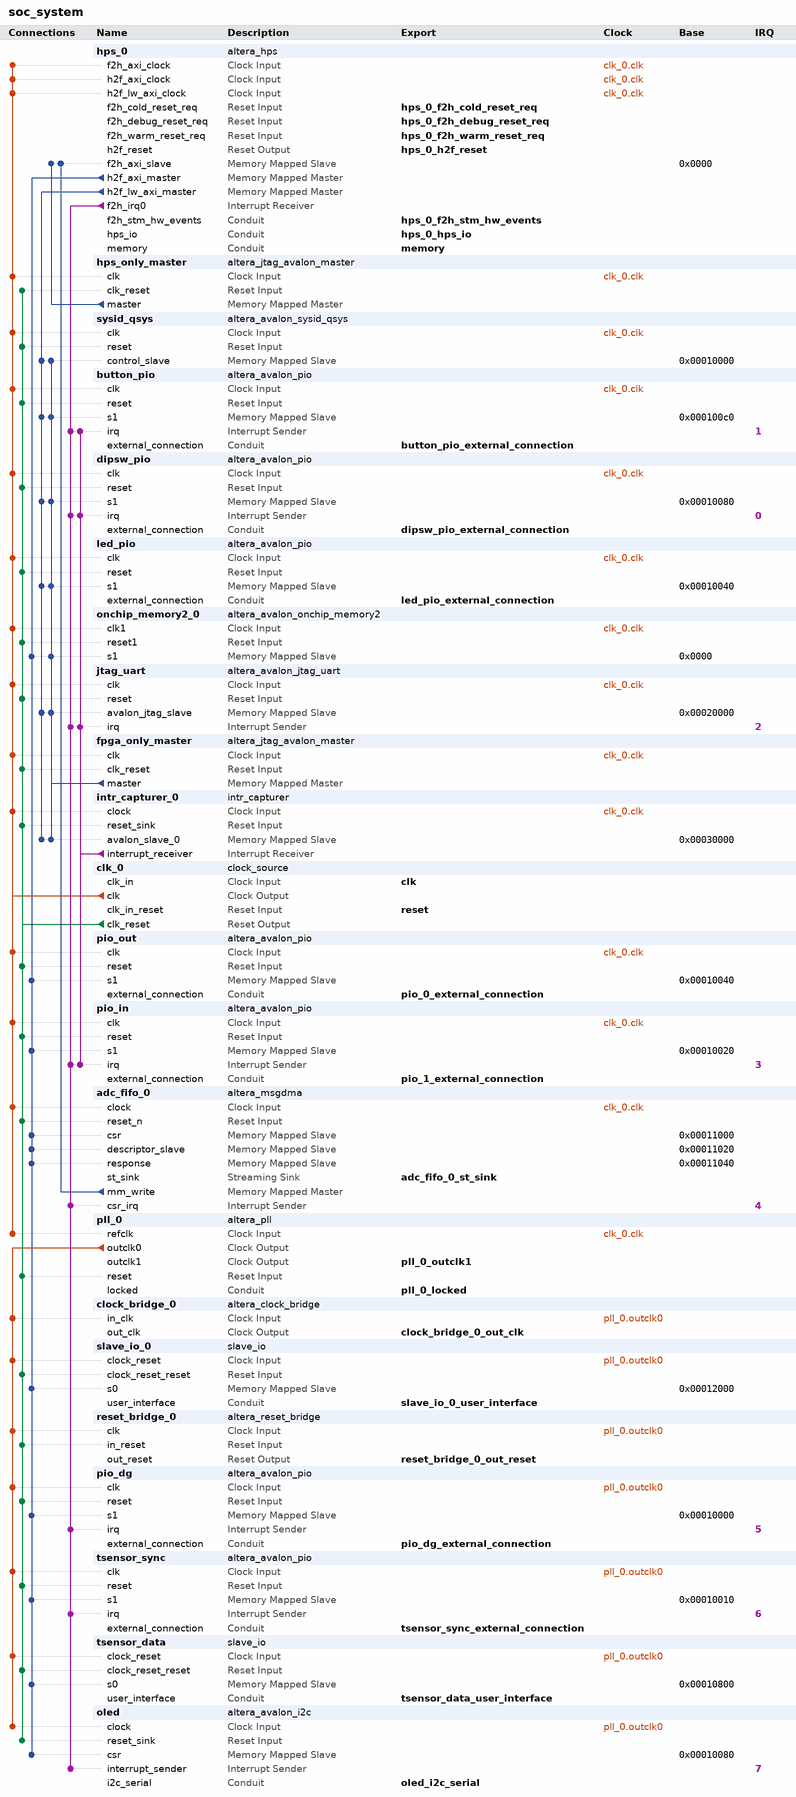
[diagram p0: system contents]
# Platform Designer (Qsys) system soc_system, Cyclone V 5CSEMA4U23C6
# Parameters at their usual value, and those the tool derives, are not listed.
package require -exact qsys 20.1
create_system soc_system
set_project_property DEVICE_FAMILY {Cyclone V}
set_project_property DEVICE 5CSEMA4U23C6

add_instance hps_0 altera_hps 20.1
set_instance_parameter_value hps_0 EMAC1_Mode RGMII
set_instance_parameter_value hps_0 EMAC1_PinMuxing {HPS I/O Set 0}
set_instance_parameter_value hps_0 F2SCLK_COLDRST_Enable true
set_instance_parameter_value hps_0 F2SCLK_DBGRST_Enable true
set_instance_parameter_value hps_0 F2SCLK_WARMRST_Enable true
set_instance_parameter_value hps_0 F2SINTERRUPT_Enable true
set_instance_parameter_value hps_0 F2S_Width 3
set_instance_parameter_value hps_0 FPGA_PERIPHERAL_OUTPUT_CLOCK_FREQ_EMAC0_GTX_CLK 100
set_instance_parameter_value hps_0 FPGA_PERIPHERAL_OUTPUT_CLOCK_FREQ_EMAC0_MD_CLK 100.0
set_instance_parameter_value hps_0 FPGA_PERIPHERAL_OUTPUT_CLOCK_FREQ_EMAC1_GTX_CLK 100
set_instance_parameter_value hps_0 FPGA_PERIPHERAL_OUTPUT_CLOCK_FREQ_EMAC1_MD_CLK 100.0
set_instance_parameter_value hps_0 HPS_PROTOCOL DDR3
set_instance_parameter_value hps_0 I2C0_Mode I2C
set_instance_parameter_value hps_0 I2C0_PinMuxing {HPS I/O Set 0}
set_instance_parameter_value hps_0 I2C1_Mode I2C
set_instance_parameter_value hps_0 I2C1_PinMuxing {HPS I/O Set 0}
set_instance_parameter_value hps_0 LWH2F_Enable true
set_instance_parameter_value hps_0 MEM_BANKADDR_WIDTH 3
set_instance_parameter_value hps_0 MEM_CLK_FREQ 400.0
set_instance_parameter_value hps_0 MEM_COL_ADDR_WIDTH 10
set_instance_parameter_value hps_0 MEM_DQ_WIDTH 32
set_instance_parameter_value hps_0 MEM_DRV_STR RZQ/6
set_instance_parameter_value hps_0 MEM_ROW_ADDR_WIDTH 15
set_instance_parameter_value hps_0 MEM_RTT_NOM RZQ/6
set_instance_parameter_value hps_0 MEM_RTT_WR {Dynamic ODT off}
set_instance_parameter_value hps_0 MEM_TCL 7
set_instance_parameter_value hps_0 MEM_TFAW_NS 37.5
set_instance_parameter_value hps_0 MEM_TRAS_NS 35.0
set_instance_parameter_value hps_0 MEM_TRCD_NS 13.75
set_instance_parameter_value hps_0 MEM_TRFC_NS 300.0
set_instance_parameter_value hps_0 MEM_TRP_NS 13.75
set_instance_parameter_value hps_0 MEM_VENDOR Other
set_instance_parameter_value hps_0 MEM_WTCL 7
set_instance_parameter_value hps_0 QSPI_Mode N/A
set_instance_parameter_value hps_0 QSPI_PinMuxing Unused
set_instance_parameter_value hps_0 REF_CLK_FREQ 25.0
set_instance_parameter_value hps_0 S2FCLK_USER2CLK 5
set_instance_parameter_value hps_0 S2F_Width 2
set_instance_parameter_value hps_0 SDIO_Mode {4-bit Data}
set_instance_parameter_value hps_0 SDIO_PinMuxing {HPS I/O Set 0}
set_instance_parameter_value hps_0 SPIM1_Mode {Single Slave Select}
set_instance_parameter_value hps_0 SPIM1_PinMuxing {HPS I/O Set 0}
set_instance_parameter_value hps_0 STM_Enable true
set_instance_parameter_value hps_0 TIMING_BOARD_AC_SKEW 0.02
set_instance_parameter_value hps_0 TIMING_BOARD_AC_TO_CK_SKEW 0.0
set_instance_parameter_value hps_0 TIMING_BOARD_DQ_TO_DQS_SKEW 0.0
set_instance_parameter_value hps_0 TIMING_BOARD_MAX_CK_DELAY 0.6
set_instance_parameter_value hps_0 TIMING_BOARD_MAX_DQS_DELAY 0.6
set_instance_parameter_value hps_0 TIMING_BOARD_SKEW_BETWEEN_DQS 0.02
set_instance_parameter_value hps_0 TIMING_BOARD_SKEW_CKDQS_DIMM_MAX 0.01
set_instance_parameter_value hps_0 TIMING_BOARD_SKEW_CKDQS_DIMM_MIN -0.01
set_instance_parameter_value hps_0 TIMING_BOARD_SKEW_WITHIN_DQS 0.02
set_instance_parameter_value hps_0 TIMING_TDH 125
set_instance_parameter_value hps_0 TIMING_TDQSCK 400
set_instance_parameter_value hps_0 TIMING_TDQSQ 120
set_instance_parameter_value hps_0 TIMING_TDS 50
set_instance_parameter_value hps_0 TIMING_TIH 250
set_instance_parameter_value hps_0 TIMING_TIS 175
set_instance_parameter_value hps_0 TIMING_TQSH 0.38
set_instance_parameter_value hps_0 UART0_Mode {No Flow Control}
set_instance_parameter_value hps_0 UART0_PinMuxing {HPS I/O Set 0}
set_instance_parameter_value hps_0 USB1_Mode SDR
set_instance_parameter_value hps_0 USB1_PinMuxing {HPS I/O Set 0}
set_instance_parameter_value hps_0 desired_cfg_clk_mhz 100.0
set_instance_parameter_value hps_0 desired_qspi_clk_mhz 370.0

add_instance hps_only_master altera_jtag_avalon_master 20.1

add_instance sysid_qsys altera_avalon_sysid_qsys 20.1
set_instance_parameter_value sysid_qsys id -1395322110

add_instance button_pio altera_avalon_pio 20.1
set_instance_parameter_value button_pio bitClearingEdgeCapReg true
set_instance_parameter_value button_pio captureEdge true
set_instance_parameter_value button_pio direction Input
set_instance_parameter_value button_pio edgeType FALLING
set_instance_parameter_value button_pio generateIRQ true
set_instance_parameter_value button_pio irqType EDGE
set_instance_parameter_value button_pio width 4

add_instance dipsw_pio altera_avalon_pio 20.1
set_instance_parameter_value dipsw_pio bitClearingEdgeCapReg true
set_instance_parameter_value dipsw_pio captureEdge true
set_instance_parameter_value dipsw_pio direction Input
set_instance_parameter_value dipsw_pio edgeType ANY
set_instance_parameter_value dipsw_pio generateIRQ true
set_instance_parameter_value dipsw_pio irqType EDGE
set_instance_parameter_value dipsw_pio width 4

add_instance led_pio altera_avalon_pio 20.1
set_instance_parameter_value led_pio direction Output
set_instance_parameter_value led_pio width 8

add_instance onchip_memory2_0 altera_avalon_onchip_memory2 20.1
set_instance_parameter_value onchip_memory2_0 dataWidth 64
set_instance_parameter_value onchip_memory2_0 dualPort false
set_instance_parameter_value onchip_memory2_0 initMemContent true
set_instance_parameter_value onchip_memory2_0 initializationFileName onchip_memory2_0
set_instance_parameter_value onchip_memory2_0 memorySize 65536

add_instance jtag_uart altera_avalon_jtag_uart 20.1
set_instance_parameter_value jtag_uart allowMultipleConnections true
set_instance_parameter_value jtag_uart simInteractiveOptions INTERACTIVE_ASCII_OUTPUT

add_instance fpga_only_master altera_jtag_avalon_master 20.1

add_instance intr_capturer_0 intr_capturer 100.99.98.97

add_instance clk_0 clock_source 20.1
set_instance_parameter_value clk_0 clockFrequency 50000000

add_instance pio_out altera_avalon_pio 20.1
set_instance_parameter_value pio_out direction Output
set_instance_parameter_value pio_out resetValue 15
set_instance_parameter_value pio_out width 4

add_instance pio_in altera_avalon_pio 20.1
set_instance_parameter_value pio_in bitClearingEdgeCapReg true
set_instance_parameter_value pio_in captureEdge true
set_instance_parameter_value pio_in direction Input
set_instance_parameter_value pio_in edgeType FALLING
set_instance_parameter_value pio_in generateIRQ true
set_instance_parameter_value pio_in irqType EDGE
set_instance_parameter_value pio_in width 2

add_instance adc_fifo_0 altera_msgdma 20.1
set_instance_parameter_value adc_fifo_0 BURST_ENABLE 0
set_instance_parameter_value adc_fifo_0 DATA_FIFO_DEPTH 32
set_instance_parameter_value adc_fifo_0 DATA_WIDTH 512
set_instance_parameter_value adc_fifo_0 DESCRIPTOR_FIFO_DEPTH 128
set_instance_parameter_value adc_fifo_0 ENHANCED_FEATURES 0
set_instance_parameter_value adc_fifo_0 ERROR_ENABLE 0
set_instance_parameter_value adc_fifo_0 MAX_BURST_COUNT 2
set_instance_parameter_value adc_fifo_0 MAX_BYTE 1024
set_instance_parameter_value adc_fifo_0 MODE 2
set_instance_parameter_value adc_fifo_0 PACKET_ENABLE 1
set_instance_parameter_value adc_fifo_0 RESPONSE_PORT 0
set_instance_parameter_value adc_fifo_0 TRANSFER_TYPE {Aligned Accesses}

add_instance pll_0 altera_pll 20.1
set_instance_parameter_value pll_0 gui_device_speed_grade 1
set_instance_parameter_value pll_0 gui_number_of_clocks 2
set_instance_parameter_value pll_0 gui_operation_mode direct
set_instance_parameter_value pll_0 gui_output_clock_frequency0 100.0
set_instance_parameter_value pll_0 gui_output_clock_frequency1 1.0
set_instance_parameter_value pll_0 gui_pll_mode {Integer-N PLL}
set_instance_parameter_value pll_0 gui_reference_clock_frequency 50.0
set_instance_parameter_value pll_0 gui_use_locked true

add_instance clock_bridge_0 altera_clock_bridge 20.1
set_instance_parameter_value clock_bridge_0 DERIVED_CLOCK_RATE 100000000
set_instance_parameter_value clock_bridge_0 EXPLICIT_CLOCK_RATE 0

add_instance slave_io_0 slave_io 2.0
set_instance_parameter_value slave_io_0 DATA_WIDTH 64
set_instance_parameter_value slave_io_0 ENABLE_SYNC_SIGNALS 1
set_instance_parameter_value slave_io_0 IRQ_EN 0
set_instance_parameter_value slave_io_0 MODE_0 2
set_instance_parameter_value slave_io_0 MODE_1 2
set_instance_parameter_value slave_io_0 MODE_10 2
set_instance_parameter_value slave_io_0 MODE_11 2
set_instance_parameter_value slave_io_0 MODE_12 2
set_instance_parameter_value slave_io_0 MODE_13 2
set_instance_parameter_value slave_io_0 MODE_14 2
set_instance_parameter_value slave_io_0 MODE_15 2
set_instance_parameter_value slave_io_0 MODE_2 2
set_instance_parameter_value slave_io_0 MODE_3 2
set_instance_parameter_value slave_io_0 MODE_4 2
set_instance_parameter_value slave_io_0 MODE_5 2
set_instance_parameter_value slave_io_0 MODE_6 2
set_instance_parameter_value slave_io_0 MODE_7 2
set_instance_parameter_value slave_io_0 MODE_8 2
set_instance_parameter_value slave_io_0 MODE_9 2

add_instance reset_bridge_0 altera_reset_bridge 20.1
set_instance_parameter_value reset_bridge_0 ACTIVE_LOW_RESET 1
set_instance_parameter_value reset_bridge_0 SYNCHRONOUS_EDGES deassert

add_instance pio_dg altera_avalon_pio 20.1
set_instance_parameter_value pio_dg bitClearingEdgeCapReg true
set_instance_parameter_value pio_dg captureEdge true
set_instance_parameter_value pio_dg direction Input
set_instance_parameter_value pio_dg generateIRQ true
set_instance_parameter_value pio_dg irqType EDGE
set_instance_parameter_value pio_dg width 1

add_instance tsensor_sync altera_avalon_pio 20.1
set_instance_parameter_value tsensor_sync bitClearingEdgeCapReg true
set_instance_parameter_value tsensor_sync captureEdge true
set_instance_parameter_value tsensor_sync direction Input
set_instance_parameter_value tsensor_sync generateIRQ true
set_instance_parameter_value tsensor_sync irqType EDGE
set_instance_parameter_value tsensor_sync width 1

add_instance tsensor_data slave_io 2.0
set_instance_parameter_value tsensor_data DATA_WIDTH 32
set_instance_parameter_value tsensor_data ENABLE_SYNC_SIGNALS 1
set_instance_parameter_value tsensor_data IRQ_EN 0
set_instance_parameter_value tsensor_data MODE_0 2
set_instance_parameter_value tsensor_data MODE_1 2
set_instance_parameter_value tsensor_data MODE_10 2
set_instance_parameter_value tsensor_data MODE_11 2
set_instance_parameter_value tsensor_data MODE_12 2
set_instance_parameter_value tsensor_data MODE_13 2
set_instance_parameter_value tsensor_data MODE_14 2
set_instance_parameter_value tsensor_data MODE_15 2
set_instance_parameter_value tsensor_data MODE_2 2
set_instance_parameter_value tsensor_data MODE_3 2
set_instance_parameter_value tsensor_data MODE_4 2
set_instance_parameter_value tsensor_data MODE_5 2
set_instance_parameter_value tsensor_data MODE_6 2
set_instance_parameter_value tsensor_data MODE_7 2
set_instance_parameter_value tsensor_data MODE_8 2
set_instance_parameter_value tsensor_data MODE_9 2

add_instance oled altera_avalon_i2c 20.1
set_instance_parameter_value oled FIFO_DEPTH 4

# connections
add_connection clk_0.clk adc_fifo_0.clock clock
add_connection clk_0.clk button_pio.clk clock
add_connection clk_0.clk dipsw_pio.clk clock
add_connection clk_0.clk fpga_only_master.clk clock
add_connection clk_0.clk hps_0.f2h_axi_clock clock
add_connection clk_0.clk hps_0.h2f_axi_clock clock
add_connection clk_0.clk hps_0.h2f_lw_axi_clock clock
add_connection clk_0.clk hps_only_master.clk clock
add_connection clk_0.clk intr_capturer_0.clock clock
add_connection clk_0.clk jtag_uart.clk clock
add_connection clk_0.clk led_pio.clk clock
add_connection clk_0.clk onchip_memory2_0.clk1 clock
add_connection clk_0.clk pio_in.clk clock
add_connection clk_0.clk pio_out.clk clock
add_connection clk_0.clk pll_0.refclk clock
add_connection clk_0.clk sysid_qsys.clk clock
add_connection pll_0.outclk0 clock_bridge_0.in_clk clock
add_connection pll_0.outclk0 oled.clock clock
add_connection pll_0.outclk0 pio_dg.clk clock
add_connection pll_0.outclk0 reset_bridge_0.clk clock
add_connection pll_0.outclk0 slave_io_0.clock_reset clock
add_connection pll_0.outclk0 tsensor_data.clock_reset clock
add_connection pll_0.outclk0 tsensor_sync.clk clock
add_connection clk_0.clk_reset adc_fifo_0.reset_n reset
add_connection clk_0.clk_reset button_pio.reset reset
add_connection clk_0.clk_reset dipsw_pio.reset reset
add_connection clk_0.clk_reset fpga_only_master.clk_reset reset
add_connection clk_0.clk_reset hps_only_master.clk_reset reset
add_connection clk_0.clk_reset intr_capturer_0.reset_sink reset
add_connection clk_0.clk_reset jtag_uart.reset reset
add_connection clk_0.clk_reset led_pio.reset reset
add_connection clk_0.clk_reset oled.reset_sink reset
add_connection clk_0.clk_reset onchip_memory2_0.reset1 reset
add_connection clk_0.clk_reset pio_dg.reset reset
add_connection clk_0.clk_reset pio_in.reset reset
add_connection clk_0.clk_reset pio_out.reset reset
add_connection clk_0.clk_reset pll_0.reset reset
add_connection clk_0.clk_reset reset_bridge_0.in_reset reset
add_connection clk_0.clk_reset slave_io_0.clock_reset_reset reset
add_connection clk_0.clk_reset sysid_qsys.reset reset
add_connection clk_0.clk_reset tsensor_data.clock_reset_reset reset
add_connection clk_0.clk_reset tsensor_sync.reset reset
add_connection adc_fifo_0.mm_write hps_0.f2h_axi_slave avalon
set_connection_parameter_value adc_fifo_0.mm_write/hps_0.f2h_axi_slave baseAddress 0x0000
add_connection fpga_only_master.master button_pio.s1 avalon
set_connection_parameter_value fpga_only_master.master/button_pio.s1 baseAddress 0x000100c0
add_connection fpga_only_master.master dipsw_pio.s1 avalon
set_connection_parameter_value fpga_only_master.master/dipsw_pio.s1 baseAddress 0x00010080
add_connection fpga_only_master.master intr_capturer_0.avalon_slave_0 avalon
set_connection_parameter_value fpga_only_master.master/intr_capturer_0.avalon_slave_0 baseAddress 0x00030000
add_connection fpga_only_master.master jtag_uart.avalon_jtag_slave avalon
set_connection_parameter_value fpga_only_master.master/jtag_uart.avalon_jtag_slave baseAddress 0x00020000
add_connection fpga_only_master.master led_pio.s1 avalon
set_connection_parameter_value fpga_only_master.master/led_pio.s1 baseAddress 0x00010040
add_connection fpga_only_master.master onchip_memory2_0.s1 avalon
set_connection_parameter_value fpga_only_master.master/onchip_memory2_0.s1 baseAddress 0x0000
add_connection fpga_only_master.master sysid_qsys.control_slave avalon
set_connection_parameter_value fpga_only_master.master/sysid_qsys.control_slave baseAddress 0x00010000
add_connection hps_0.h2f_axi_master adc_fifo_0.csr avalon
set_connection_parameter_value hps_0.h2f_axi_master/adc_fifo_0.csr baseAddress 0x00011000
add_connection hps_0.h2f_axi_master adc_fifo_0.descriptor_slave avalon
set_connection_parameter_value hps_0.h2f_axi_master/adc_fifo_0.descriptor_slave baseAddress 0x00011020
add_connection hps_0.h2f_axi_master adc_fifo_0.response avalon
set_connection_parameter_value hps_0.h2f_axi_master/adc_fifo_0.response baseAddress 0x00011040
add_connection hps_0.h2f_axi_master oled.csr avalon
set_connection_parameter_value hps_0.h2f_axi_master/oled.csr baseAddress 0x00010080
add_connection hps_0.h2f_axi_master onchip_memory2_0.s1 avalon
set_connection_parameter_value hps_0.h2f_axi_master/onchip_memory2_0.s1 baseAddress 0x0000
add_connection hps_0.h2f_axi_master pio_dg.s1 avalon
set_connection_parameter_value hps_0.h2f_axi_master/pio_dg.s1 baseAddress 0x00010000
add_connection hps_0.h2f_axi_master pio_in.s1 avalon
set_connection_parameter_value hps_0.h2f_axi_master/pio_in.s1 baseAddress 0x00010020
add_connection hps_0.h2f_axi_master pio_out.s1 avalon
set_connection_parameter_value hps_0.h2f_axi_master/pio_out.s1 baseAddress 0x00010040
add_connection hps_0.h2f_axi_master slave_io_0.s0 avalon
set_connection_parameter_value hps_0.h2f_axi_master/slave_io_0.s0 baseAddress 0x00012000
add_connection hps_0.h2f_axi_master tsensor_data.s0 avalon
set_connection_parameter_value hps_0.h2f_axi_master/tsensor_data.s0 baseAddress 0x00010800
add_connection hps_0.h2f_axi_master tsensor_sync.s1 avalon
set_connection_parameter_value hps_0.h2f_axi_master/tsensor_sync.s1 baseAddress 0x00010010
add_connection hps_0.h2f_lw_axi_master button_pio.s1 avalon
set_connection_parameter_value hps_0.h2f_lw_axi_master/button_pio.s1 baseAddress 0x000100c0
add_connection hps_0.h2f_lw_axi_master dipsw_pio.s1 avalon
set_connection_parameter_value hps_0.h2f_lw_axi_master/dipsw_pio.s1 baseAddress 0x00010080
add_connection hps_0.h2f_lw_axi_master intr_capturer_0.avalon_slave_0 avalon
set_connection_parameter_value hps_0.h2f_lw_axi_master/intr_capturer_0.avalon_slave_0 baseAddress 0x00030000
add_connection hps_0.h2f_lw_axi_master jtag_uart.avalon_jtag_slave avalon
set_connection_parameter_value hps_0.h2f_lw_axi_master/jtag_uart.avalon_jtag_slave baseAddress 0x00020000
add_connection hps_0.h2f_lw_axi_master led_pio.s1 avalon
set_connection_parameter_value hps_0.h2f_lw_axi_master/led_pio.s1 baseAddress 0x00010040
add_connection hps_0.h2f_lw_axi_master sysid_qsys.control_slave avalon
set_connection_parameter_value hps_0.h2f_lw_axi_master/sysid_qsys.control_slave baseAddress 0x00010000
add_connection hps_only_master.master hps_0.f2h_axi_slave avalon
set_connection_parameter_value hps_only_master.master/hps_0.f2h_axi_slave baseAddress 0x0000
add_connection hps_0.f2h_irq0 adc_fifo_0.csr_irq interrupt
set_connection_parameter_value hps_0.f2h_irq0/adc_fifo_0.csr_irq irqNumber 4
add_connection hps_0.f2h_irq0 button_pio.irq interrupt
set_connection_parameter_value hps_0.f2h_irq0/button_pio.irq irqNumber 1
add_connection hps_0.f2h_irq0 dipsw_pio.irq interrupt
set_connection_parameter_value hps_0.f2h_irq0/dipsw_pio.irq irqNumber 0
add_connection hps_0.f2h_irq0 jtag_uart.irq interrupt
set_connection_parameter_value hps_0.f2h_irq0/jtag_uart.irq irqNumber 2
add_connection hps_0.f2h_irq0 oled.interrupt_sender interrupt
set_connection_parameter_value hps_0.f2h_irq0/oled.interrupt_sender irqNumber 7
add_connection hps_0.f2h_irq0 pio_dg.irq interrupt
set_connection_parameter_value hps_0.f2h_irq0/pio_dg.irq irqNumber 5
add_connection hps_0.f2h_irq0 pio_in.irq interrupt
set_connection_parameter_value hps_0.f2h_irq0/pio_in.irq irqNumber 3
add_connection hps_0.f2h_irq0 tsensor_sync.irq interrupt
set_connection_parameter_value hps_0.f2h_irq0/tsensor_sync.irq irqNumber 6
add_connection intr_capturer_0.interrupt_receiver button_pio.irq interrupt
set_connection_parameter_value intr_capturer_0.interrupt_receiver/button_pio.irq irqNumber 1
add_connection intr_capturer_0.interrupt_receiver dipsw_pio.irq interrupt
set_connection_parameter_value intr_capturer_0.interrupt_receiver/dipsw_pio.irq irqNumber 0
add_connection intr_capturer_0.interrupt_receiver jtag_uart.irq interrupt
set_connection_parameter_value intr_capturer_0.interrupt_receiver/jtag_uart.irq irqNumber 2
add_connection intr_capturer_0.interrupt_receiver pio_in.irq interrupt
set_connection_parameter_value intr_capturer_0.interrupt_receiver/pio_in.irq irqNumber 3

# exported interfaces
add_interface adc_fifo_0_st_sink avalon_streaming sink
set_interface_property adc_fifo_0_st_sink EXPORT_OF adc_fifo_0.st_sink
add_interface button_pio_external_connection conduit end
set_interface_property button_pio_external_connection EXPORT_OF button_pio.external_connection
add_interface clk clock sink
set_interface_property clk EXPORT_OF clk_0.clk_in
add_interface clock_bridge_0_out_clk clock source
set_interface_property clock_bridge_0_out_clk EXPORT_OF clock_bridge_0.out_clk
add_interface dipsw_pio_external_connection conduit end
set_interface_property dipsw_pio_external_connection EXPORT_OF dipsw_pio.external_connection
add_interface hps_0_f2h_cold_reset_req reset sink
set_interface_property hps_0_f2h_cold_reset_req EXPORT_OF hps_0.f2h_cold_reset_req
add_interface hps_0_f2h_debug_reset_req reset sink
set_interface_property hps_0_f2h_debug_reset_req EXPORT_OF hps_0.f2h_debug_reset_req
add_interface hps_0_f2h_stm_hw_events conduit end
set_interface_property hps_0_f2h_stm_hw_events EXPORT_OF hps_0.f2h_stm_hw_events
add_interface hps_0_f2h_warm_reset_req reset sink
set_interface_property hps_0_f2h_warm_reset_req EXPORT_OF hps_0.f2h_warm_reset_req
add_interface hps_0_h2f_reset reset source
set_interface_property hps_0_h2f_reset EXPORT_OF hps_0.h2f_reset
add_interface hps_0_hps_io conduit end
set_interface_property hps_0_hps_io EXPORT_OF hps_0.hps_io
add_interface led_pio_external_connection conduit end
set_interface_property led_pio_external_connection EXPORT_OF led_pio.external_connection
add_interface memory conduit end
set_interface_property memory EXPORT_OF hps_0.memory
add_interface oled_i2c_serial conduit end
set_interface_property oled_i2c_serial EXPORT_OF oled.i2c_serial
add_interface pio_0_external_connection conduit end
set_interface_property pio_0_external_connection EXPORT_OF pio_out.external_connection
add_interface pio_1_external_connection conduit end
set_interface_property pio_1_external_connection EXPORT_OF pio_in.external_connection
add_interface pio_dg_external_connection conduit end
set_interface_property pio_dg_external_connection EXPORT_OF pio_dg.external_connection
add_interface pll_0_locked conduit end
set_interface_property pll_0_locked EXPORT_OF pll_0.locked
add_interface pll_0_outclk1 clock source
set_interface_property pll_0_outclk1 EXPORT_OF pll_0.outclk1
add_interface reset reset sink
set_interface_property reset EXPORT_OF clk_0.clk_in_reset
add_interface reset_bridge_0_out_reset reset source
set_interface_property reset_bridge_0_out_reset EXPORT_OF reset_bridge_0.out_reset
add_interface slave_io_0_user_interface conduit end
set_interface_property slave_io_0_user_interface EXPORT_OF slave_io_0.user_interface
add_interface tsensor_data_user_interface conduit end
set_interface_property tsensor_data_user_interface EXPORT_OF tsensor_data.user_interface
add_interface tsensor_sync_external_connection conduit end
set_interface_property tsensor_sync_external_connection EXPORT_OF tsensor_sync.external_connection

set_interconnect_requirement {$system} qsys_mm.clockCrossingAdapter HANDSHAKE
set_interconnect_requirement {$system} qsys_mm.maxAdditionalLatency 1

save_system soc_system.qsys
